# Altium project Orient.PrjPcb (part 3 of 6)

## Sheet HDMI.SchDoc
size A
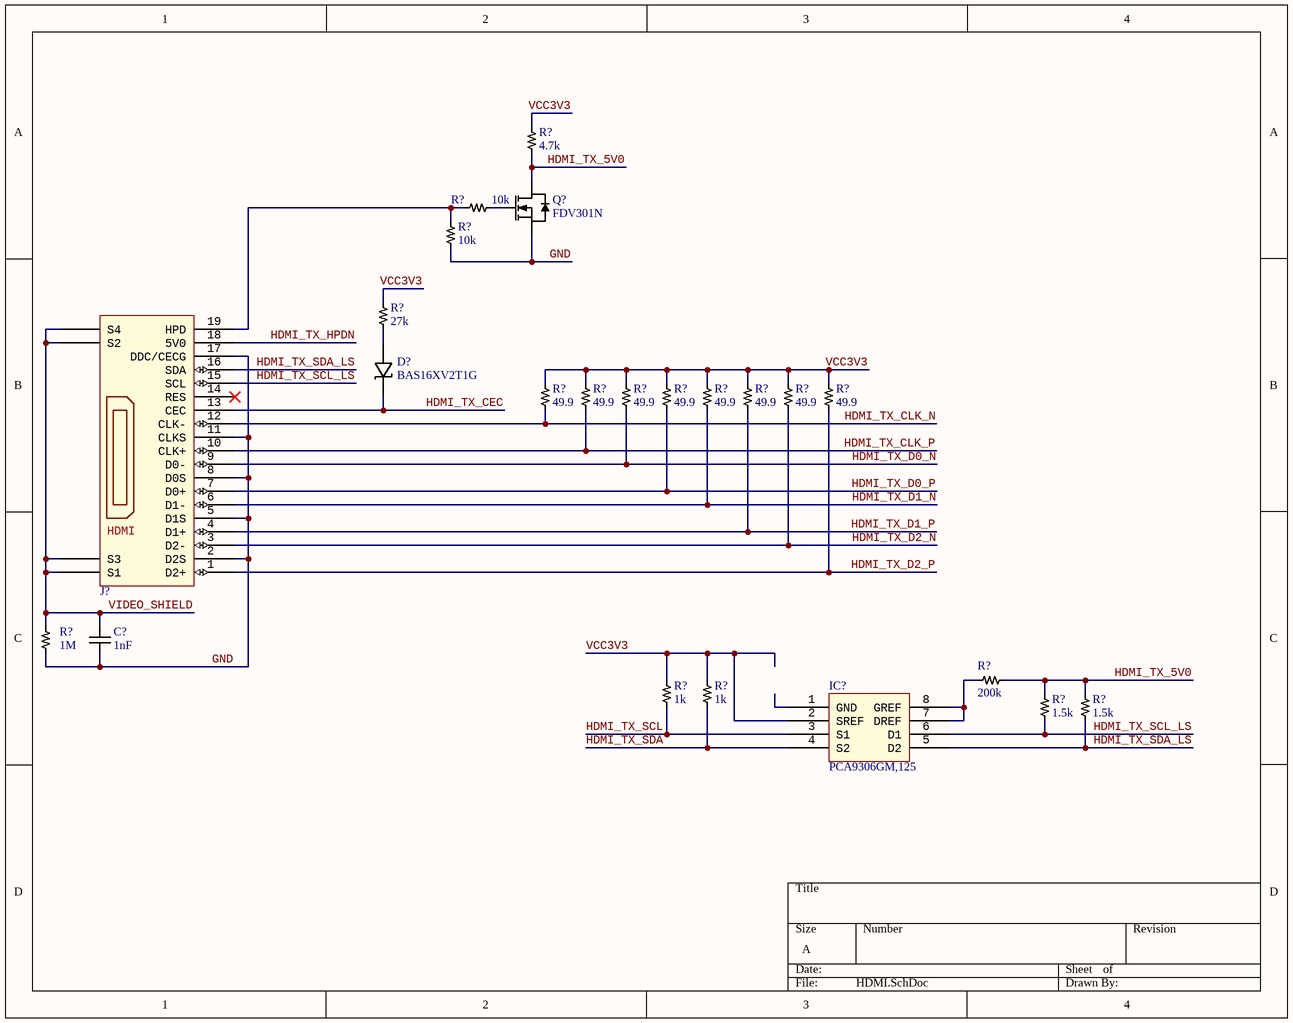
[diagram p3: HDMI.SchDoc]

### Parts
(Parts that share a designator on the sheet are numbered #1, #2 ... from top to bottom, then left to right.)
C?#10  1nF  [CAP0603]
D?#21  BAS16XV2T1G
IC?#3  PCA9306GM,125  [XQFN8]
J?#10  HDMI Connector  [HDMI]  (value not drawn)
Q?#1  FDV301N  [SOT-23]
R?#100  4.7k  [RES0402]
R?#101  10k  [RES0402]
R?#102  10k  [RES0402]
R?#103  27k  [RES0402]
R?#104  49.9  [RES0402]
R?#105  49.9  [RES0402]
R?#106  49.9  [RES0402]
R?#107  49.9  [RES0402]
R?#108  49.9  [RES0402]
R?#109  49.9  [RES0402]
R?#110  49.9  [RES0402]
R?#111  49.9  [RES0402]
R?#112  1M  [RES0402]
R?#113  200k  [RES0402]
R?#114  1k  [RES0402]
R?#115  1k  [RES0402]
R?#116  1.5k  [RES0402]
R?#117  1.5k  [RES0402]

### Nets
GND: C?#10.2 J?#10.2(D2S) J?#10.5(D1S) J?#10.8(D0S) J?#10.11(CLKS) J?#10.17(DDC/CECG) Q?#1.2(S) R?#102.1 R?#112.1
HDMI_TX_5V0: Q?#1.3(D) R?#100.1 R?#113.2 R?#116.2 R?#117.2
HDMI_TX_CEC: D?#21.1(C) J?#10.13(CEC)
HDMI_TX_CLK_N: J?#10.12(CLK-) R?#104.1
HDMI_TX_CLK_P: J?#10.10(CLK+) R?#105.1
HDMI_TX_D0_N: J?#10.9(D0-) R?#106.1
HDMI_TX_D0_P: J?#10.7(D0+) R?#107.1
HDMI_TX_D1_N: J?#10.6(D1-) R?#108.1
HDMI_TX_D1_P: J?#10.4(D1+) R?#109.1
HDMI_TX_D2_N: J?#10.3(D2-) R?#110.1
HDMI_TX_D2_P: J?#10.1(D2+) R?#111.1
HDMI_TX_HPDN: J?#10.18(5V0)
HDMI_TX_SCL: IC?#3.3(S1) R?#114.1
HDMI_TX_SCL_LS: IC?#3.6(D1) J?#10.15(SCL) R?#116.1
HDMI_TX_SDA: IC?#3.4(S2) R?#115.1
HDMI_TX_SDA_LS: IC?#3.5(D2) J?#10.16(SDA) R?#117.1
VCC3V3: IC?#3.2(SREF) R?#100.2 R?#103.2 R?#104.2 R?#105.2 R?#106.2 R?#107.2 R?#108.2 R?#109.2 R?#110.2 R?#111.2 R?#114.2 R?#115.2
VIDEO_SHIELD: C?#10.1 J?#10.S1 J?#10.S2 J?#10.S3 J?#10.S4 R?#112.2
NetD?#21_2: D?#21.2(A) R?#103.1
NetIC?#3_7: IC?#3.7(DREF) IC?#3.8(GREF) R?#113.1
NetJ?#10_19: J?#10.19(HPD) R?#101.1 R?#102.2
NetQ?#1_1: Q?#1.1(G) R?#101.2

Not connected (* = marked no-connect by the designer): IC?#3 1(GND); J?#10 14(RES)*

### Library data of the parts
C?#10 = CC0603KRX7RYBB102: MLCC 1nF 250V 0603 SMD; Manufacturer: Yageo; Tolerance: 10%; Supplier 1: Digi-Key; Manufacturer Part Number: CC0603KRX7RYBB102; Stock 1: 12106; Pricing 1: 1=0.19000, 10=0.12900, 100=0.06540, 500=0.04478, 1000=0.03961 (USD); RoHS: Yes; Mount: Surface Mount; Case/Package: 0603; Min Operating Temperature: -55°C; Max Operating Temperature: 125°C; Packaging: Tape and Reel; Capacitance: 1nF; Voltage Rating: 250V; Length: 0.063inch; Width: 0.031inch; Thickness: 0.035inch; ComponentLink1URL: http://www.yageo.com/exep/pages/download/literatures/ProductSelectionGuide%202014_Final_2.pdf?src-supplier=Digi-Key; ComponentLink1Description: http://www.yageo.com/exep/pages/download/literatures/ProductSelectionGuide%202014_Final_2.pdf?src-supplier=Digi-Key; ComponentLink2URL: http://www.yageo.com/documents/recent/UPY-NP0X7R_MV_100-to-630V_21.pdf?src-supplier=Digi-Key; ComponentLink2Description: http://www.yageo.com/documents/recent/UPY-NP0X7R_MV_100-to-630V_21.pdf?src-supplier=Digi-Key
D?#21 = BAS16XV2T1G: DIODE GEN PURP 75V 200MA SOD523; Manufacturer: ON Semiconductor; Peak Reverse Current: 1uA; Reverse Recovery Time: 6ns; Power Dissipation: 200mW; Element Configuration: Single; Max Surge Current: 500mA; Forward Voltage: 1.25V; Polarity: Standard; Capacitance: 2pF; Supplier 1: Digi-Key; Manufacturer Part Number: BAS16XV2T1G; Stock 1: 246361; Pricing 1: 1=0.13000, 10=0.11600, 100=0.06330, 500=0.03898, 1000=0.02658 (USD); RoHS: Yes; Case/Package: SOD-523-2; Number of Pins: 2; Contact Plating: Tin,Matte; Min Operating Temperature: -55°C; Max Operating Temperature: 150°C; Package Quantity: 1; Forward Current: 200mA; Packaging: Tape and Reel; Average Rectified Current: 200mA; Max Repetitive Reverse Voltage (Vrrm): 75V; Max Reverse Voltage (DC): 75V; Recovery Time: 6ns; Max Reverse Leakage Current: 1uA; Peak Non-Repetitive Surge Current: 500mA; Max Forward Surge Current (Ifsm): 500mA; Output Current: 200mA; Length: 1.3mm; Height: 0.7mm; Width: 0.9mm; Radiation Hardening: No; Lead Free: Lead Free; Halogen Free: Halogen Free; REACH SVHC: No SVHC; ComponentLink1URL: https://datasheet.ciiva.com/915/bas16xv2t1-d-915360.pdf?src-supplier=Digi-Key; ComponentLink1Description: https://datasheet.ciiva.com/915/bas16xv2t1-d-915360.pdf?src-supplier=Digi-Key; ComponentLink2URL: https://datasheet.ciiva.com/4434/bas16xv2t1-d-103464-4434928.pdf?src-supplier=Mouser; ComponentLink2Description: https://datasheet.ciiva.com/4434/bas16xv2t1-d-103464-4434928.pdf?src-supplier=Mouser; ComponentLink3URL: https://datasheet.ciiva.com/22663/1708232-22663646.pdf?src-supplier=Element14; ComponentLink3Description: https://datasheet.ciiva.com/22663/1708232-22663646.pdf?src-supplier=Element14; ComponentLink4URL: https://datasheet.ciiva.com/36525/806485-36525908.pdf?src-supplier=Jameco; ComponentLink4Description: https://datasheet.ciiva.com/36525/806485-36525908.pdf?src-supplier=Jameco; ComponentLink5URL: https://datasheet.ciiva.com/15144/getdatasheetpartid-84399-15144565.pdf?src-supplier=Verical; ComponentLink5Description: https://datasheet.ciiva.com/15144/getdatasheetpartid-84399-15144565.pdf?src-supplier=Verical; ComponentLink6URL: https://datasheet.ciiva.com/16475/bas16xv2t1-d-16475723.pdf?src-supplier=Avnet+Asia; ComponentLink6Description: https://datasheet.ciiva.com/16475/bas16xv2t1-d-16475723.pdf?src-supplier=Avnet+Asia; ComponentLink7URL: https://datasheet.ciiva.com/25930/bas16xv2t1-d-25930683.pdf?src-supplier=Avnet+Europe; ComponentLink7Description: https://datasheet.ciiva.com/25930/bas16xv2t1-d-25930683.pdf?src-supplier=Avnet+Europe
IC?#3 = PCA9306GM,125: Low Voltage Translator, Bidirectional; Manufacturer: NXP Semiconductors; Max Supply Voltage: 5V; Min Supply Voltage: 0uV; Number of Channels: 2; Propagation Delay: 3.3ns; Supplier 1: Digi-Key; Manufacturer Part Number: PCA9306GM,125; Stock 1: 9822; Pricing 1: 1=0.74000, 10=0.65200, 100=0.50010, 500=0.39532, 1000=0.31626 (USD); RoHS: Yes; Mount: Surface Mount; Case/Package: QFN; Number of Pins: 8; Contact Plating: Gold; Min Operating Temperature: -40°C; Max Operating Temperature: 85°C; Packaging: Tape and Reel; Package Quantity: 1; Logic Function: Translator; Number of Bits: 2; Turn-On Delay Time: 3.3ns; Output Type: Voltage; Length: 1.65mm; Height: 0.45mm; Width: 1.65mm; Radiation Hardening: No; Lead Free: Lead Free; ComponentLink1URL: https://datasheet.ciiva.com/1898/pca9306-1898993.pdf?src-supplier=Digi-Key; ComponentLink1Description: https://datasheet.ciiva.com/1898/pca9306-1898993.pdf?src-supplier=Digi-Key; ComponentLink2URL: https://datasheet.ciiva.com/1898/pca9306-1898994.pdf?src-supplier=Digi-Key; ComponentLink2Description: https://datasheet.ciiva.com/1898/pca9306-1898994.pdf?src-supplier=Digi-Key; ComponentLink3URL: https://datasheet.ciiva.com/1898/pca9306-1898995.pdf?src-supplier=Digi-Key; ComponentLink3Description: https://datasheet.ciiva.com/1898/pca9306-1898995.pdf?src-supplier=Digi-Key; ComponentLink4URL: https://datasheet.ciiva.com/16209/pca9306-16209430.pdf?src-supplier=Future+Electronics; ComponentLink4Description: https://datasheet.ciiva.com/16209/pca9306-16209430.pdf?src-supplier=Future+Electronics; ComponentLink5URL: https://datasheet.ciiva.com/8243/pca9306-8243976.pdf?src-supplier=Avnet; ComponentLink5Description: https://datasheet.ciiva.com/8243/pca9306-8243976.pdf?src-supplier=Avnet; ComponentLink6URL: https://datasheet.ciiva.com/16671/pca9306-16671482.pdf?src-supplier=Avnet+Europe; ComponentLink6Description: https://datasheet.ciiva.com/16671/pca9306-16671482.pdf?src-supplier=Avnet+Europe
J?#10 = 10029449-111RLF: HDMI 1.4 Connector 19 Position; Manufacturer: Amphenol FCI; Body Material: Stainless Steel; Gender: Receptacle; Voltage Rating: 40V; Number of Contacts: 19; Insulation Resistance: 100MR; Number of Ports: 1; Pitch: 0.5mm; Supplier 1: Digi-Key; Manufacturer Part Number: 10029449-111RLF; Stock 1: 21394; Pricing 1: 1=0.80000, 10=0.74700, 25=0.67200, 50=0.59740, 100=0.57250 (USD); RoHS: Yes; Mount: Surface Mount,Horizontal; Contact Material: Copper Alloy,Bronze; Contact Plating: Gold; Color: Black; Number of Terminals: 19; Housing Material: Thermoplastic; Min Operating Temperature: -55°C; Max Operating Temperature: 85°C; Termination: Solder; Orientation: Right Angle; Package Quantity: 400; Packaging: Tape and Reel; Connector Type: HDMI; Number of Positions: 19; Max Voltage Rating (AC): 40V; Features: Shielded; Length: 15.7mm; Depth: 9.5mm; Radiation Hardening: No; REACH SVHC: No SVHC; Lead Free: Lead Free; ComponentLink1URL: https://datasheet.ciiva.com/851/10029449-851120.pdf?src-supplier=Digi-Key; ComponentLink1Description: https://datasheet.ciiva.com/851/10029449-851120.pdf?src-supplier=Digi-Key; ComponentLink2URL: https://datasheet.ciiva.com/851/10029449-851118.pdf?src-supplier=Digi-Key; ComponentLink2Description: https://datasheet.ciiva.com/851/10029449-851118.pdf?src-supplier=Digi-Key; ComponentLink3URL: https://datasheet.ciiva.com/851/10029449-851119.pdf?src-supplier=Digi-Key; ComponentLink3Description: https://datasheet.ciiva.com/851/10029449-851119.pdf?src-supplier=Digi-Key
Q?#1 = FDV301N: Digital FET, N-Channel, 0.35 W, 25 V, -55 to 150 degC, 3-Pin SOT23, RoHS, Tape and Reel; Manufacturer: Fairchild; Rds(on) Test Voltage Vgs: 2.7V; Threshold Voltage Vgs Typ: 850mV; Voltage Vds Typ: 25V; Reel Quantity: 3000; Voltage Vgs Rds on Measurement: 4.5V; Power Dissipation Pd: 350mW; Continuous Drain Current Id: 220mA; Transistor Polarity: NChannel; No. of Transistors: 1; Package Version: Rev. 12, 03/2016; Voltage Vgs th Max: 1.5V; ESD HBM: 6kV; Pulse Current Idm: 500mA; Current Temperature: 25degC; On Resistance Rds(on): 5ohm; External Depth: 2.5mm; SMD Marking: 301; No. of Pins: 3; External Width: 3.05mm; SVHC: NoSVHC(19-Dec-2012); External Length / Height: 1.12mm; Termination Type: SMD; Transistor Case Style: SOT-23; Package Reference: SOT23-3; Package URL: http://www.fairchildsemi.com/dwg/MA/MA03D.pdf; Voltage Vgs Max: 850mV; Drain Source Voltage Vds: 25V; Operating Temperature Max: 150degC; Package Description: 3-Pin Small Outline Transistor, Body 2.92 x 1.325 mm, Pitch 0.95 mm; Operating Temperature Min: -55degC; Datasheet Version: Jun-09; Tape Width: 8mm; Full Power Rating Temperature: 25degC; Datasheet URL: https://datasheet.ciiva.com/8114/fdv301n-8114688.pdf; Package / Case: SOT-23; Manufacturer URL: https://www.fairchildsemi.com/; Current Id Max: 220mA; Operating Temperature Range: -55degCto+150degC
R?#100 = RC0402FR-074K7L: Resistor 4.7kOhm 0402 SMD; Manufacturer: Yageo; Voltage Rating (DC): 50V; Tolerance: 1%; Power Rating: 62.5mW; Resistance: 4.7kR; Temperature Coefficient: 100ppm/°C; Supplier 1: Digi-Key; Manufacturer Part Number: RC0402FR-074K7L; Stock 1: 23742940; Pricing 1: 1=0.10000, 10=0.01600, 100=0.00670, 1000=0.00301, 2500=0.00261, 5000=0.00215 (USD); RoHS: Yes; Case/Package: 0402; Number of Pins: 2; Case Code (Imperial): 0402; Case Code (Metric): 1005; Min Operating Temperature: -55°C; Max Operating Temperature: 155°C; Voltage Rating: 50V; Packaging: Tape and Reel; Composition: Thick Film; Termination: SMD/SMT; Military Standard: Not; Length: 1mm; Height: 0.32mm; Width: 0.5mm; Depth: 0.5mm; REACH SVHC: No SVHC; Lead Free: Lead Free; ComponentLink1URL: https://datasheet.ciiva.com/7850/1018594-7850022.pdf?src-supplier=Element14; ComponentLink1Description: https://datasheet.ciiva.com/7850/1018594-7850022.pdf?src-supplier=Element14; ComponentLink2URL: https://datasheet.ciiva.com/7850/1018594-7850023.pdf?src-supplier=Element14; ComponentLink2Description: https://datasheet.ciiva.com/7850/1018594-7850023.pdf?src-supplier=Element14; ComponentLink3URL: https://datasheet.ciiva.com/15215/getdatasheetpartid-328119-15215035.pdf?src-supplier=Verical; ComponentLink3Description: https://datasheet.ciiva.com/15215/getdatasheetpartid-328119-15215035.pdf?src-supplier=Verical; ComponentLink4URL: https://datasheet.ciiva.com/22661/1686128-22661342.pdf?src-supplier=Element14; ComponentLink4Description: https://datasheet.ciiva.com/22661/1686128-22661342.pdf?src-supplier=Element14
R?#101 R?#102 = RC0402FR-0710KL: Resistor 10kOhm 0402 SMD; Manufacturer: Yageo; Resistance: 10kR; Tolerance: 1%; Temperature Coefficient: 100ppm/°C; Voltage Rating: 50V; Power Rating: 62.5mW; Supplier 1: Digi-Key; Manufacturer Part Number: RC0402FR-0710KL; Stock 1: 78932647; Pricing 1: 1=0.10000, 10=0.01500, 100=0.00630, 1000=0.00281, 2500=0.00244, 5000=0.00201 (USD); RoHS: Yes; Case/Package: 0402; Number of Pins: 2; Case Code (Imperial): 0402; Case Code (Metric): 1005; Min Operating Temperature: -55°C; Max Operating Temperature: 155°C; Packaging: Tape and Reel; Composition: Thick Film; Voltage Rating (DC): 50V; Termination: SMD/SMT; Military Standard: Not; Working Voltage: 50V; Number of Terminations: 2; Length: 1mm; Height: 0.32mm; Width: 0.5mm; Depth: 0.5mm; Lead Pitch: 0.2mm; REACH SVHC: No SVHC; Lead Free: Lead Free; ComponentLink1URL: https://datasheet.ciiva.com/7660/38568-7660787.pdf?src-supplier=Element14; ComponentLink1Description: https://datasheet.ciiva.com/7660/38568-7660787.pdf?src-supplier=Element14; ComponentLink2URL: https://datasheet.ciiva.com/7983/1018594-7983486.pdf?src-supplier=Element14; ComponentLink2Description: https://datasheet.ciiva.com/7983/1018594-7983486.pdf?src-supplier=Element14; ComponentLink3URL: https://datasheet.ciiva.com/7849/1784430-7849813.pdf?src-supplier=Element14; ComponentLink3Description: https://datasheet.ciiva.com/7849/1784430-7849813.pdf?src-supplier=Element14; ComponentLink4URL: https://datasheet.ciiva.com/7849/1686128-7849814.pdf?src-supplier=Element14; ComponentLink4Description: https://datasheet.ciiva.com/7849/1686128-7849814.pdf?src-supplier=Element14; ComponentLink5URL: https://datasheet.ciiva.com/7849/1784430-7849815.pdf?src-supplier=Element14; ComponentLink5Description: https://datasheet.ciiva.com/7849/1784430-7849815.pdf?src-supplier=Element14; ComponentLink6URL: https://datasheet.ciiva.com/22747/1018594-22747512.pdf?src-supplier=Element14; ComponentLink6Description: https://datasheet.ciiva.com/22747/1018594-22747512.pdf?src-supplier=Element14; ComponentLink7URL: https://datasheet.ciiva.com/12667/pyu-rc0402-51-rohs-l-6-r-12667067.pdf?src-supplier=Mouser; ComponentLink7Description: https://datasheet.ciiva.com/12667/pyu-rc0402-51-rohs-l-6-r-12667067.pdf?src-supplier=Mouser
R?#103 = RC0402FR-0727KL: Resistor 27kOhm 0402 SMD; Manufacturer: Yageo; Resistance: 27kR; Tolerance: 1%; Power Rating: 63mW; Voltage Rating: 50V; Temperature Coefficient: 100ppm/°C; Supplier 1: Digi-Key; Manufacturer Part Number: RC0402FR-0727KL; Stock 1: 2559160; Pricing 1: 1=0.10000, 10=0.01600, 100=0.00670, 1000=0.00301, 2500=0.00261, 5000=0.00215 (USD); RoHS: Yes; Case/Package: 0402; Case Code (Imperial): 0402; Case Code (Metric): 1005; Min Operating Temperature: -55°C; Max Operating Temperature: 155°C; Packaging: Tape and Reel; Package Quantity: 10000; Termination: SMD/SMT; Composition: Thick Film; Number of Terminations: 2; Military Standard: Not; Max Power Dissipation: 63mW; Features: Moisture Resistant; Length: 1mm; Height: 0.016inch; Width: 0.02inch; Depth: 0.5mm; REACH SVHC: Unknown; Lead Free: Lead Free; ComponentLink1URL: https://datasheet.ciiva.com/11819/0900766b80c66297-11819497.pdf?src-supplier=RSComponents; ComponentLink1Description: https://datasheet.ciiva.com/11819/0900766b80c66297-11819497.pdf?src-supplier=RSComponents; ComponentLink2URL: https://datasheet.ciiva.com/7849/1018594-7849925.pdf?src-supplier=Element14; ComponentLink2Description: https://datasheet.ciiva.com/7849/1018594-7849925.pdf?src-supplier=Element14; ComponentLink3URL: https://datasheet.ciiva.com/2453/pyu-r-int-thick-7-2453562.pdf?src-supplier=Digi-Key; ComponentLink3Description: https://datasheet.ciiva.com/2453/pyu-r-int-thick-7-2453562.pdf?src-supplier=Digi-Key; ComponentLink4URL: https://datasheet.ciiva.com/16772/pyu-rc0402-51-rohs-l-6-r-16772092.pdf?src-supplier=Future+Electronics; ComponentLink4Description: https://datasheet.ciiva.com/16772/pyu-rc0402-51-rohs-l-6-r-16772092.pdf?src-supplier=Future+Electronics
R?#104-R?#111 = RC0402FR-0749R9L: Resistor 49.9Ohm 0402 SMD; Manufacturer: Yageo; Resistance: 49.9R; Tolerance: 1%; Power Rating: 62.5mW; Voltage Rating: 50V; Temperature Coefficient: 100ppm/°C; Max Power Dissipation: 63mW; Supplier 1: Digi-Key; Manufacturer Part Number: RC0402FR-0749R9L; Stock 1: 19217561; Pricing 1: 1=0.10000, 10=0.01600, 100=0.00670, 1000=0.00301, 2500=0.00261, 5000=0.00215 (USD); RoHS: Yes; Case/Package: 0402; Number of Pins: 2; Case Code (Imperial): 0402; Case Code (Metric): 1005; Min Operating Temperature: -55°C; Max Operating Temperature: 155°C; Packaging: Tape and Reel; Package Quantity: 1; Termination: SMD/SMT; Composition: Thick Film; Number of Terminations: 2; Military Standard: Not; Voltage Rating (DC): 50V; Working Voltage: 50V; Features: Moisture Resistant; Length: 1mm; Height: 0.016inch; Width: 0.5mm; Depth: 0.5mm; REACH SVHC: No SVHC; Lead Free: Lead Free; ComponentLink1URL: https://datasheet.ciiva.com/11819/0900766b80c66297-11819508.pdf?src-supplier=RSComponents; ComponentLink1Description: https://datasheet.ciiva.com/11819/0900766b80c66297-11819508.pdf?src-supplier=RSComponents; ComponentLink2URL: https://datasheet.ciiva.com/7983/1018594-7983542.pdf?src-supplier=Element14; ComponentLink2Description: https://datasheet.ciiva.com/7983/1018594-7983542.pdf?src-supplier=Element14; ComponentLink3URL: https://datasheet.ciiva.com/16743/pyu-rc0402-51-rohs-l-6-r-16743942.pdf?src-supplier=Future+Electronics; ComponentLink3Description: https://datasheet.ciiva.com/16743/pyu-rc0402-51-rohs-l-6-r-16743942.pdf?src-supplier=Future+Electronics; ComponentLink4URL: https://datasheet.ciiva.com/22747/1018594-22747514.pdf?src-supplier=Element14; ComponentLink4Description: https://datasheet.ciiva.com/22747/1018594-22747514.pdf?src-supplier=Element14; ComponentLink5URL: https://datasheet.ciiva.com/2453/pyu-r-int-thick-7-2453355.pdf?src-supplier=Digi-Key; ComponentLink5Description: https://datasheet.ciiva.com/2453/pyu-r-int-thick-7-2453355.pdf?src-supplier=Digi-Key; ComponentLink6URL: https://datasheet.ciiva.com/2453/pyu-r-int-thick-7-2453356.pdf?src-supplier=Digi-Key; ComponentLink6Description: https://datasheet.ciiva.com/2453/pyu-r-int-thick-7-2453356.pdf?src-supplier=Digi-Key; ComponentLink7URL: https://datasheet.ciiva.com/2453/pyu-r-int-thick-7-2453357.pdf?src-supplier=Digi-Key; ComponentLink7Description: https://datasheet.ciiva.com/2453/pyu-r-int-thick-7-2453357.pdf?src-supplier=Digi-Key
R?#112 = RC0402FR-071ML: Resistor 1MOhm 0402 SMD; Manufacturer: Yageo; Resistance: 1MR; Tolerance: 1%; Power Rating: 63mW; Voltage Rating: 50V; Temperature Coefficient: 100ppm/°C; Supplier 1: Digi-Key; Manufacturer Part Number: RC0402FR-071ML; Stock 1: 12663284; Pricing 1: 1=0.10000, 10=0.01500, 100=0.00620, 1000=0.00278, 2500=0.00242, 5000=0.00200 (USD); RoHS: Yes; Case/Package: 0402; Case Code (Imperial): 0402; Case Code (Metric): 1005; Min Operating Temperature: -55°C; Max Operating Temperature: 155°C; Composition: Thick Film; Packaging: Tape and Reel; Termination: SMD/SMT; Military Standard: Not; Length: 1mm; Height: 0.32mm; Depth: 0.5mm; REACH SVHC: Unknown; Lead Free: Lead Free; ComponentLink1URL: https://datasheet.ciiva.com/11808/0900766b80c66297-11808125.pdf?src-supplier=RSComponents; ComponentLink1Description: https://datasheet.ciiva.com/11808/0900766b80c66297-11808125.pdf?src-supplier=RSComponents; ComponentLink2URL: https://datasheet.ciiva.com/16741/pyu-rc0402-51-rohs-l-6-r-16741081.pdf?src-supplier=Future+Electronics; ComponentLink2Description: https://datasheet.ciiva.com/16741/pyu-rc0402-51-rohs-l-6-r-16741081.pdf?src-supplier=Future+Electronics; ComponentLink3URL: https://datasheet.ciiva.com/46394/1018594-46394951.pdf?src-supplier=Element14; ComponentLink3Description: https://datasheet.ciiva.com/46394/1018594-46394951.pdf?src-supplier=Element14; ComponentLink4URL: https://datasheet.ciiva.com/7849/1018594-7849882.pdf?src-supplier=Element14; ComponentLink4Description: https://datasheet.ciiva.com/7849/1018594-7849882.pdf?src-supplier=Element14; ComponentLink5URL: https://datasheet.ciiva.com/7849/1018594-7849883.pdf?src-supplier=Element14; ComponentLink5Description: https://datasheet.ciiva.com/7849/1018594-7849883.pdf?src-supplier=Element14
R?#113 = RC0402FR-07200KL: Resistor 200kOhm 0402 SMD; Manufacturer: Yageo; Power Rating: 62.5mW; Tolerance: 1%; Temperature Coefficient: 100ppm/°C; Resistance: 200kR; Voltage Rating: 50V; Max Power Dissipation: 63mW; Supplier 1: Digi-Key; Manufacturer Part Number: RC0402FR-07200KL; Stock 1: 4653507; Pricing 1: 1=0.10000, 10=0.01600, 100=0.00670, 1000=0.00301, 2500=0.00261, 5000=0.00215 (USD); RoHS: Yes; Case/Package: 0402; Case Code (Metric): 1005; Case Code (Imperial): 0402; Min Operating Temperature: -55°C; Max Operating Temperature: 155°C; Package Quantity: 1; Packaging: Tape and Reel; Composition: Thick Film; Number of Terminations: 2; Termination: SMD/SMT; Military Standard: Not; Voltage Rating (DC): 50V; Working Voltage: 50V; Features: Moisture Resistant; Length: 1mm; Height: 0.016inch; Depth: 0.5mm; Width: 0.02inch; REACH SVHC: No SVHC; Lead Free: Lead Free; ComponentLink1URL: https://datasheet.ciiva.com/2453/pyu-r-int-thick-7-2453556.pdf?src-supplier=Digi-Key; ComponentLink1Description: https://datasheet.ciiva.com/2453/pyu-r-int-thick-7-2453556.pdf?src-supplier=Digi-Key; ComponentLink2URL: https://datasheet.ciiva.com/2453/pyu-r-int-thick-7-2453557.pdf?src-supplier=Digi-Key; ComponentLink2Description: https://datasheet.ciiva.com/2453/pyu-r-int-thick-7-2453557.pdf?src-supplier=Digi-Key; ComponentLink3URL: https://datasheet.ciiva.com/15189/getdatasheetpartid-323720-15189381.pdf?src-supplier=Verical; ComponentLink3Description: https://datasheet.ciiva.com/15189/getdatasheetpartid-323720-15189381.pdf?src-supplier=Verical; ComponentLink4URL: https://datasheet.ciiva.com/2453/pyu-r-int-thick-7-2453558.pdf?src-supplier=Digi-Key; ComponentLink4Description: https://datasheet.ciiva.com/2453/pyu-r-int-thick-7-2453558.pdf?src-supplier=Digi-Key; ComponentLink5URL: https://datasheet.ciiva.com/12667/pyu-rc0402-51-rohs-l-6-r-12667911.pdf?src-supplier=Mouser; ComponentLink5Description: https://datasheet.ciiva.com/12667/pyu-rc0402-51-rohs-l-6-r-12667911.pdf?src-supplier=Mouser; ComponentLink6URL: https://datasheet.ciiva.com/7849/1018594-7849896.pdf?src-supplier=Element14; ComponentLink6Description: https://datasheet.ciiva.com/7849/1018594-7849896.pdf?src-supplier=Element14; ComponentLink7URL: https://datasheet.ciiva.com/7849/1018594-7849897.pdf?src-supplier=Element14; ComponentLink7Description: https://datasheet.ciiva.com/7849/1018594-7849897.pdf?src-supplier=Element14; ComponentLink8URL: https://datasheet.ciiva.com/46394/1018594-46394953.pdf?src-supplier=Element14; ComponentLink8Description: https://datasheet.ciiva.com/46394/1018594-46394953.pdf?src-supplier=Element14; ComponentLink9URL: https://datasheet.ciiva.com/16740/pyu-rc0402-51-rohs-l-6-r-16740636.pdf?src-supplier=Future+Electronics; ComponentLink9Description: https://datasheet.ciiva.com/16740/pyu-rc0402-51-rohs-l-6-r-16740636.pdf?src-supplier=Future+Electronics
R?#114 R?#115 = RC0402FR-071KL: Resistor 1kOhm 0402 SMD; Manufacturer: Yageo; Tolerance: 1%; Resistance: 1kR; Temperature Coefficient: 100ppm/°C; Voltage Rating (DC): 50V; Power Rating: 62.5mW; Supplier 1: Digi-Key; Manufacturer Part Number: RC0402FR-071KL; Stock 1: 60632232; Pricing 1: 1=0.10000, 10=0.01600, 100=0.00670, 1000=0.00301, 2500=0.00261, 5000=0.00215 (USD); RoHS: Yes; Case/Package: 0402; Number of Pins: 2; Case Code (Imperial): 0402; Case Code (Metric): 1005; Min Operating Temperature: -55°C; Max Operating Temperature: 155°C; Composition: Thick Film; Packaging: Tape and Reel; Voltage Rating: 50V; Termination: SMD/SMT; Military Standard: Not; Length: 1mm; Height: 0.32mm; Width: 0.5mm; Depth: 0.5mm; REACH SVHC: Unknown; Lead Free: Lead Free; ComponentLink1URL: https://datasheet.ciiva.com/11819/0900766b80c66297-11819477.pdf?src-supplier=RSComponents; ComponentLink1Description: https://datasheet.ciiva.com/11819/0900766b80c66297-11819477.pdf?src-supplier=RSComponents; ComponentLink2URL: https://datasheet.ciiva.com/12666/pyu-rc0402-51-rohs-l-6-r-12666741.pdf?src-supplier=Mouser; ComponentLink2Description: https://datasheet.ciiva.com/12666/pyu-rc0402-51-rohs-l-6-r-12666741.pdf?src-supplier=Mouser; ComponentLink3URL: https://datasheet.ciiva.com/17063/pyu-rc0402-51-rohs-l-6-r-17063193.pdf?src-supplier=Future+Electronics; ComponentLink3Description: https://datasheet.ciiva.com/17063/pyu-rc0402-51-rohs-l-6-r-17063193.pdf?src-supplier=Future+Electronics; ComponentLink4URL: https://datasheet.ciiva.com/22747/1018594-22747513.pdf?src-supplier=Element14; ComponentLink4Description: https://datasheet.ciiva.com/22747/1018594-22747513.pdf?src-supplier=Element14; ComponentLink5URL: https://datasheet.ciiva.com/7849/1018594-7849869.pdf?src-supplier=Element14; ComponentLink5Description: https://datasheet.ciiva.com/7849/1018594-7849869.pdf?src-supplier=Element14; ComponentLink6URL: https://datasheet.ciiva.com/7983/1018594-7983502.pdf?src-supplier=Element14; ComponentLink6Description: https://datasheet.ciiva.com/7983/1018594-7983502.pdf?src-supplier=Element14; ComponentLink7URL: https://datasheet.ciiva.com/7849/1018594-7849871.pdf?src-supplier=Element14; ComponentLink7Description: https://datasheet.ciiva.com/7849/1018594-7849871.pdf?src-supplier=Element14
R?#116 R?#117 = RC0402FR-071K5L: Resistor 1.5kOhm 0402 SMD; Manufacturer: Yageo; Resistance: 1.5kR; Power Rating: 62.5mW; Tolerance: 1%; Voltage Rating: 50V; Temperature Coefficient: 100ppm/°C; Max Power Dissipation: 63mW; Supplier 1: Digi-Key; Manufacturer Part Number: RC0402FR-071K5L; Stock 1: 9153842; Pricing 1: 1=0.10000, 10=0.01600, 100=0.00670, 1000=0.00301, 2500=0.00261, 5000=0.00215 (USD); RoHS: Yes; Case/Package: 0402; Case Code (Metric): 1005; Case Code (Imperial): 0402; Min Operating Temperature: -55°C; Max Operating Temperature: 155°C; Composition: Thick Film; Package Quantity: 1; Packaging: Tape and Reel; Number of Terminations: 2; Termination: SMD/SMT; Military Standard: Not; Features: Moisture Resistant; Length: 1mm; Height: 0.016inch; Width: 0.02inch; Depth: 0.5mm; REACH SVHC: No SVHC; Lead Free: Lead Free; ComponentLink1URL: https://datasheet.ciiva.com/11808/0900766b80c66297-11808238.pdf?src-supplier=RSComponents; ComponentLink1Description: https://datasheet.ciiva.com/11808/0900766b80c66297-11808238.pdf?src-supplier=RSComponents; ComponentLink2URL: https://datasheet.ciiva.com/2453/pyu-r-int-thick-7-2453440.pdf?src-supplier=Digi-Key; ComponentLink2Description: https://datasheet.ciiva.com/2453/pyu-r-int-thick-7-2453440.pdf?src-supplier=Digi-Key; ComponentLink3URL: https://datasheet.ciiva.com/2453/pyu-r-int-thick-7-2453441.pdf?src-supplier=Digi-Key; ComponentLink3Description: https://datasheet.ciiva.com/2453/pyu-r-int-thick-7-2453441.pdf?src-supplier=Digi-Key; ComponentLink4URL: https://datasheet.ciiva.com/46394/1018594-46394950.pdf?src-supplier=Element14; ComponentLink4Description: https://datasheet.ciiva.com/46394/1018594-46394950.pdf?src-supplier=Element14; ComponentLink5URL: https://datasheet.ciiva.com/7849/1018594-7849863.pdf?src-supplier=Element14; ComponentLink5Description: https://datasheet.ciiva.com/7849/1018594-7849863.pdf?src-supplier=Element14; ComponentLink6URL: https://datasheet.ciiva.com/7849/1018594-7849864.pdf?src-supplier=Element14; ComponentLink6Description: https://datasheet.ciiva.com/7849/1018594-7849864.pdf?src-supplier=Element14; ComponentLink7URL: https://datasheet.ciiva.com/15189/getdatasheetpartid-323992-15189370.pdf?src-supplier=Verical; ComponentLink7Description: https://datasheet.ciiva.com/15189/getdatasheetpartid-323992-15189370.pdf?src-supplier=Verical; ComponentLink8URL: https://datasheet.ciiva.com/12558/pyu-rc0402-51-rohs-l-6-r-8721-12558542.pdf?src-supplier=Mouser; ComponentLink8Description: https://datasheet.ciiva.com/12558/pyu-rc0402-51-rohs-l-6-r-8721-12558542.pdf?src-supplier=Mouser; ComponentLink9URL: https://datasheet.ciiva.com/2453/pyu-r-int-thick-7-2453439.pdf?src-supplier=Digi-Key; ComponentLink9Description: https://datasheet.ciiva.com/2453/pyu-r-int-thick-7-2453439.pdf?src-supplier=Digi-Key

## Sheet USB_Mic_Audio_Out.SchDoc
size A

## Sheet FPGA_Config_Flash.SchDoc
size A
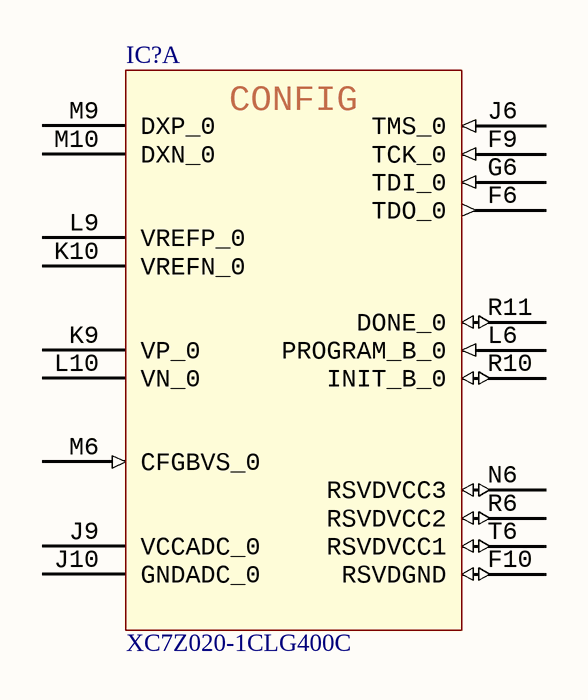
[diagram p4: FPGA_Config_Flash.SchDoc]

### Parts
(Parts that share a designator on the sheet are numbered #1, #2 ... from top to bottom, then left to right.)
IC?#4  XC7Z020-1CLG400C  [BGA400]  (part A of 9)

### Nets

Not connected (* = marked no-connect by the designer): IC?#4 F6(TDO_0) F9(TCK_0) F10(RSVDGND) G6(TDI_0) J6(TMS_0) J9(VCCADC_0) J10(GNDADC_0) K9(VP_0) K10(VREFN_0) L6(PROGRAM_B_0) L9(VREFP_0) L10(VN_0) M6(CFGBVS_0) M9(DXP_0) M10(DXN_0) N6(RSVDVCC3) R6(RSVDVCC2) R10(INIT_B_0) R11(DONE_0) T6(RSVDVCC1)

### Notes on the sheet
- (in symbol XC7Z020-1CLG400C, part A) CONFIG

### Library data of the parts
IC?#4 = XC7Z020-1CLG400C: Zynq-7000 SoC.; ComponentLink1Description: Digi-Key; ComponentLink1URL: https://www.digikey.com/product-detail/en/xilinx-inc/XC7Z020-1CLG400C/122-1851-ND/3925758?utm_adgroup=Integrated Circuits&slid=&gclid=Cj0KCQjwn_LrBRD4ARIsAFEQFKtYXIOPieaS_xsLL2AvFALkVw3M5siD0KQOWM0owpA_yiQuHKATBqcaAuQ6EALw_wcB

## Sheet DDR_MIO_Banks.SchDoc
size A
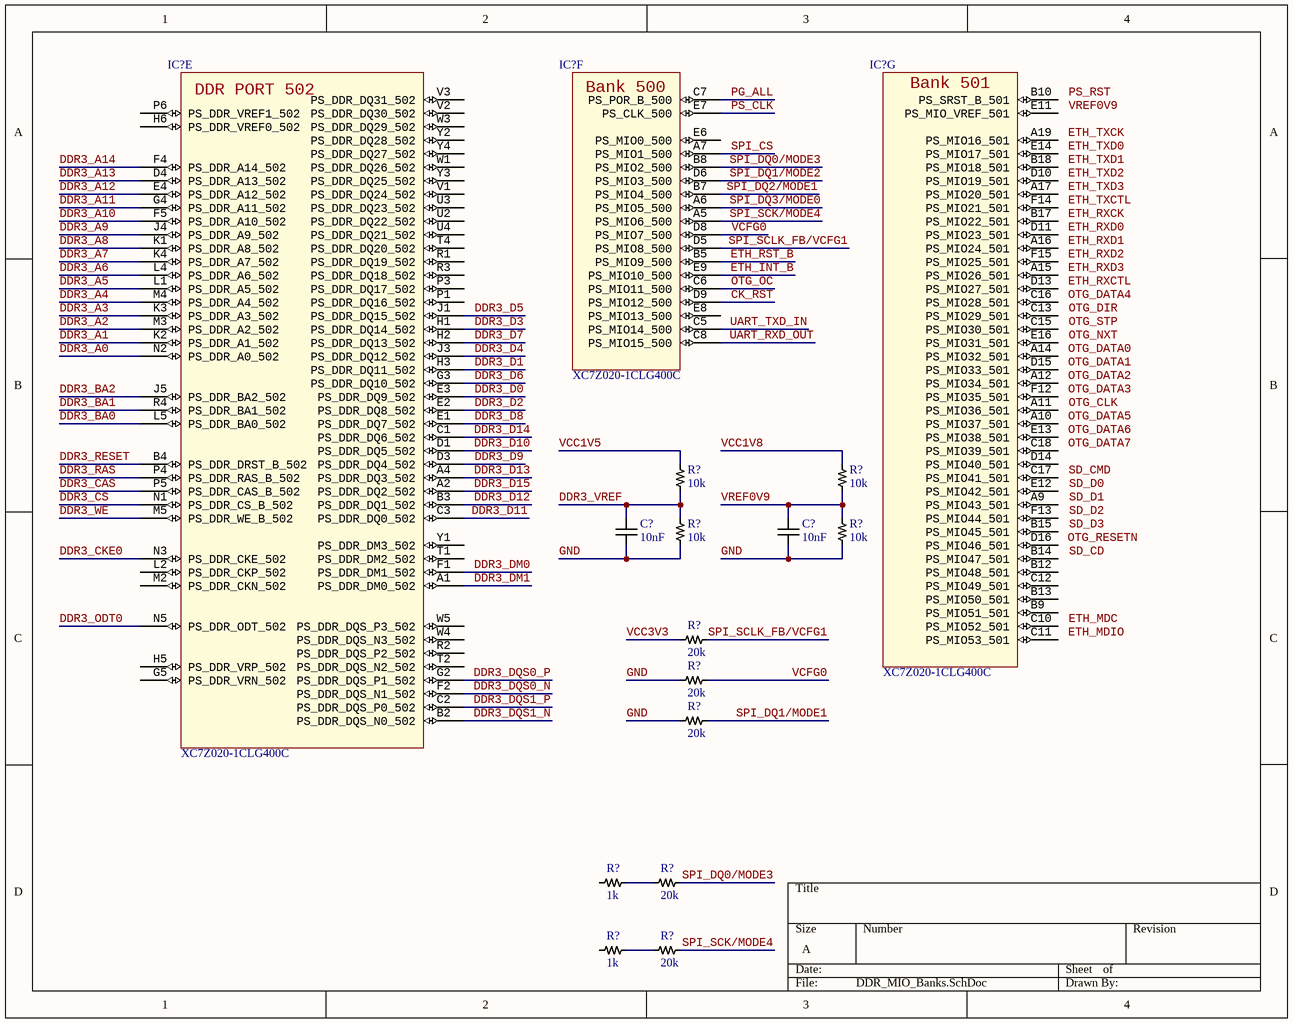
[diagram p5: DDR_MIO_Banks.SchDoc]

### Parts
(Parts that share a designator on the sheet are numbered #1, #2 ... from top to bottom, then left to right.)
C?#11  10nF  [CAP0402]
C?#12  10nF  [CAP0402]
IC?#5  XC7Z020-1CLG400C  [BGA400]  (part F of 9)
IC?#6  XC7Z020-1CLG400C  [BGA400]  (part G of 9)
IC?#7  XC7Z020-1CLG400C  [BGA400]  (part E of 9)
R?#118  10k  [RES0402]
R?#119  10k  [RES0402]
R?#120  10k  [RES0402]
R?#121  10k  [RES0402]
R?#122  20k  [RES0402]
R?#123  20k  [RES0402]
R?#124  20k  [RES0402]
R?#125  1k  [RES0402]
R?#126  20k  [RES0402]
R?#127  1k  [RES0402]
R?#128  20k  [RES0402]

### Nets
GND: C?#11.2 C?#12.2 R?#120.1 R?#121.1 R?#123.1 R?#124.1
CK_RST: IC?#5.D9(PS_MIO12_500)
DDR3_A0: IC?#7.N2(PS_DDR_A0_502)
DDR3_A1: IC?#7.K2(PS_DDR_A1_502)
DDR3_A2: IC?#7.M3(PS_DDR_A2_502)
DDR3_A3: IC?#7.K3(PS_DDR_A3_502)
DDR3_A4: IC?#7.M4(PS_DDR_A4_502)
DDR3_A5: IC?#7.L1(PS_DDR_A5_502)
DDR3_A6: IC?#7.L4(PS_DDR_A6_502)
DDR3_A7: IC?#7.K4(PS_DDR_A7_502)
DDR3_A8: IC?#7.K1(PS_DDR_A8_502)
DDR3_A9: IC?#7.J4(PS_DDR_A9_502)
DDR3_A10: IC?#7.F5(PS_DDR_A10_502)
DDR3_A11: IC?#7.G4(PS_DDR_A11_502)
DDR3_A12: IC?#7.E4(PS_DDR_A12_502)
DDR3_A13: IC?#7.D4(PS_DDR_A13_502)
DDR3_A14: IC?#7.F4(PS_DDR_A14_502)
DDR3_BA0: IC?#7.L5(PS_DDR_BA0_502)
DDR3_BA1: IC?#7.R4(PS_DDR_BA1_502)
DDR3_BA2: IC?#7.J5(PS_DDR_BA2_502)
DDR3_CAS: IC?#7.P5(PS_DDR_CAS_B_502)
DDR3_CKE0: IC?#7.N3(PS_DDR_CKE_502)
DDR3_CS: IC?#7.N1(PS_DDR_CS_B_502)
DDR3_D0: IC?#7.E3(PS_DDR_DQ9_502)
DDR3_D1: IC?#7.H3(PS_DDR_DQ11_502)
DDR3_D2: IC?#7.E2(PS_DDR_DQ8_502)
DDR3_D3: IC?#7.H1(PS_DDR_DQ14_502)
DDR3_D4: IC?#7.J3(PS_DDR_DQ12_502)
DDR3_D5: IC?#7.J1(PS_DDR_DQ15_502)
DDR3_D6: IC?#7.G3(PS_DDR_DQ10_502)
DDR3_D7: IC?#7.H2(PS_DDR_DQ13_502)
DDR3_D8: IC?#7.E1(PS_DDR_DQ7_502)
DDR3_D9: IC?#7.D3(PS_DDR_DQ4_502)
DDR3_D10: IC?#7.D1(PS_DDR_DQ5_502)
DDR3_D11: IC?#7.C3(PS_DDR_DQ0_502)
DDR3_D12: IC?#7.B3(PS_DDR_DQ1_502)
DDR3_D13: IC?#7.A4(PS_DDR_DQ3_502)
DDR3_D14: IC?#7.C1(PS_DDR_DQ6_502)
DDR3_D15: IC?#7.A2(PS_DDR_DQ2_502)
DDR3_DM0: IC?#7.F1(PS_DDR_DM1_502)
DDR3_DM1: IC?#7.A1(PS_DDR_DM0_502)
DDR3_DQS0_N: IC?#7.F2(PS_DDR_DQS_N1_502)
DDR3_DQS0_P: IC?#7.G2(PS_DDR_DQS_P1_502)
DDR3_DQS1_N: IC?#7.B2(PS_DDR_DQS_N0_502)
DDR3_DQS1_P: IC?#7.C2(PS_DDR_DQS_P0_502)
DDR3_ODT0: IC?#7.N5(PS_DDR_ODT_502)
DDR3_RAS: IC?#7.P4(PS_DDR_RAS_B_502)
DDR3_RESET: IC?#7.B4(PS_DDR_DRST_B_502)
DDR3_VREF: C?#11.1 R?#118.1 R?#120.2
DDR3_WE: IC?#7.M5(PS_DDR_WE_B_502)
ETH_INT_B: IC?#5.E9(PS_MIO10_500)
ETH_RST_B: IC?#5.B5(PS_MIO9_500)
OTG_OC: IC?#5.C6(PS_MIO11_500)
PG_ALL: IC?#5.C7(PS_POR_B_500)
PS_CLK: IC?#5.E7(PS_CLK_500)
SPI_CS: IC?#5.A7(PS_MIO1_500)
SPI_DQ0/MODE3: IC?#5.B8(PS_MIO2_500) R?#126.2
SPI_DQ1/MODE1: R?#124.2
SPI_DQ1/MODE2: IC?#5.D6(PS_MIO3_500)
SPI_DQ2/MODE1: IC?#5.B7(PS_MIO4_500)
SPI_DQ3/MODE0: IC?#5.A6(PS_MIO5_500)
SPI_SCK/MODE4: IC?#5.A5(PS_MIO6_500) R?#128.2
SPI_SCLK_FB/VCFG1: IC?#5.D5(PS_MIO8_500) R?#122.2
UART_RXD_OUT: IC?#5.C8(PS_MIO15_500)
UART_TXD_IN: IC?#5.C5(PS_MIO14_500)
VCC1V5: R?#118.2
VCC1V8: R?#119.2
VCC3V3: R?#122.1
VCFG0: IC?#5.D8(PS_MIO7_500) R?#123.2
VREF0V9: C?#12.1 R?#119.1 R?#121.2
NetR?#125_2: R?#125.2 R?#126.1
NetR?#127_2: R?#127.2 R?#128.1

Not connected (* = marked no-connect by the designer): IC?#5 E6(PS_MIO0_500) E8(PS_MIO13_500); IC?#6 A9(PS_MIO43_501) A10(PS_MIO37_501) A11(PS_MIO36_501) A12(PS_MIO34_501) A14(PS_MIO32_501) A15(PS_MIO26_501) A16(PS_MIO24_501) A17(PS_MIO20_501) A19(PS_MIO16_501) B9(PS_MIO51_501) B10(PS_SRST_B_501) B12(PS_MIO48_501) B13(PS_MIO50_501) B14(PS_MIO47_501) B15(PS_MIO45_501) B17(PS_MIO22_501) B18(PS_MIO18_501) C10(PS_MIO52_501) C11(PS_MIO53_501) C12(PS_MIO49_501) C13(PS_MIO29_501) C15(PS_MIO30_501) C16(PS_MIO28_501) C17(PS_MIO41_501) C18(PS_MIO39_501) D10(PS_MIO19_501) D11(PS_MIO23_501) D13(PS_MIO27_501) D14(PS_MIO40_501) D15(PS_MIO33_501) D16(PS_MIO46_501) E11(PS_MIO_VREF_501) E12(PS_MIO42_501) E13(PS_MIO38_501) E14(PS_MIO17_501) E16(PS_MIO31_501) F12(PS_MIO35_501) F13(PS_MIO44_501) F14(PS_MIO21_501) F15(PS_MIO25_501); IC?#7 G5(PS_DDR_VRN_502) H5(PS_DDR_VRP_502) H6(PS_DDR_VREF0_502) L2(PS_DDR_CKP_502) M2(PS_DDR_CKN_502) P1(PS_DDR_DQ16_502) P3(PS_DDR_DQ17_502) P6(PS_DDR_VREF1_502) R1(PS_DDR_DQ19_502) R2(PS_DDR_DQS_P2_502) R3(PS_DDR_DQ18_502) T1(PS_DDR_DM2_502) T2(PS_DDR_DQS_N2_502) T4(PS_DDR_DQ20_502) U2(PS_DDR_DQ22_502) U3(PS_DDR_DQ23_502) U4(PS_DDR_DQ21_502) V1(PS_DDR_DQ24_502) V2(PS_DDR_DQ30_502) V3(PS_DDR_DQ31_502) W1(PS_DDR_DQ26_502) W3(PS_DDR_DQ29_502) W4(PS_DDR_DQS_N3_502) W5(PS_DDR_DQS_P3_502) Y1(PS_DDR_DM3_502) Y2(PS_DDR_DQ28_502) Y3(PS_DDR_DQ25_502) Y4(PS_DDR_DQ27_502); R?#125 1; R?#127 1

### Notes on the sheet
- Labels drawn without touching a wire or pin: ETH_MDC, ETH_MDIO, ETH_RXCK, ETH_RXCTL, ETH_RXD0, ETH_RXD1, ETH_RXD2, ETH_RXD3, ETH_TXCK, ETH_TXCTL, ETH_TXD0, ETH_TXD1, ETH_TXD2, ETH_TXD3, OTG_CLK, OTG_DATA0, OTG_DATA1, OTG_DATA2, OTG_DATA3, OTG_DATA4, OTG_DATA5, OTG_DATA6, OTG_DATA7, OTG_DIR, OTG_NXT, OTG_RESETN, OTG_STP, PS_RST, SD_CD, SD_CMD, SD_D0, SD_D1, SD_D2, SD_D3, VREF0V9
- (in symbol XC7Z020-1CLG400C, part E) DDR PORT 502
- (in symbol XC7Z020-1CLG400C, part F) Bank 500
- (in symbol XC7Z020-1CLG400C, part G) Bank 501

### Library data of the parts
C?#11 C?#12 = GRM155R71H103KA88D: MLCC 10nF 0402 SMD; Manufacturer: Murata; Material: Ceramic; Tolerance: 10%; Voltage Rating: 50V; Dielectric: X7R; Voltage: 25V; Supplier 1: Digi-Key; Manufacturer Part Number: GRM155R71H103KA88D; Stock 1: 7384657; Pricing 1: 1=0.10000, 10=0.03800, 100=0.01690, 500=0.01208, 1000=0.00949, 2500=0.00862, 5000=0.00794 (USD); RoHS: Yes; Mount: Surface Mount; Case/Package: 0402; Number of Pins: 2; Case Code (Metric): 1005; Case Code (Imperial): 0402; Min Operating Temperature: -55°C; Max Operating Temperature: 125°C; Packaging: Tape and Reel; Package Quantity: 1; Termination: SMD/SMT; Capacitance: 10nF; Voltage Rating (DC): 50V; Length: 1mm; Height: 0.5mm; Width: 0.02inch; Thickness: 0.022inch; Depth: 0.5mm; Radiation Hardening: No; REACH SVHC: No SVHC; Lead Free: Lead Free; ComponentLink1URL: https://datasheet.ciiva.com/129/product-129810.pdf?src-supplier=Digi-Key; ComponentLink1Description: https://datasheet.ciiva.com/129/product-129810.pdf?src-supplier=Digi-Key; ComponentLink2URL: https://datasheet.ciiva.com/19476/1856433-19476546.pdf?src-supplier=Jameco; ComponentLink2Description: https://datasheet.ciiva.com/19476/1856433-19476546.pdf?src-supplier=Jameco; ComponentLink3URL: https://datasheet.ciiva.com/11786/0900766b80ef921d-11786340.pdf?src-supplier=RSComponents; ComponentLink3Description: https://datasheet.ciiva.com/11786/0900766b80ef921d-11786340.pdf?src-supplier=RSComponents; ComponentLink4URL: https://datasheet.ciiva.com/18100/getdatasheetpartid-27434-18100660.pdf?src-supplier=Verical; ComponentLink4Description: https://datasheet.ciiva.com/18100/getdatasheetpartid-27434-18100660.pdf?src-supplier=Verical; ComponentLink5URL: https://datasheet.ciiva.com/22698/1747449-22698420.pdf?src-supplier=Element14; ComponentLink5Description: https://datasheet.ciiva.com/22698/1747449-22698420.pdf?src-supplier=Element14; ComponentLink6URL: https://datasheet.ciiva.com/29199/454225-da-01-en-vs-kondensator-0402-29199740.pdf?src-supplier=Conrad; ComponentLink6Description: https://datasheet.ciiva.com/29199/454225-da-01-en-vs-kondensator-0402-29199740.pdf?src-supplier=Conrad; ComponentLink7URL: https://datasheet.ciiva.com/129/grm155r71h103ka88-01-129811.pdf?src-supplier=Digi-Key; ComponentLink7Description: https://datasheet.ciiva.com/129/grm155r71h103ka88-01-129811.pdf?src-supplier=Digi-Key; ComponentLink8URL: https://datasheet.ciiva.com/129/grm155r71h103ka88-01-129812.pdf?src-supplier=Digi-Key; ComponentLink8Description: https://datasheet.ciiva.com/129/grm155r71h103ka88-01-129812.pdf?src-supplier=Digi-Key; ComponentLink9URL: https://datasheet.ciiva.com/16495/product-16495290.pdf?src-supplier=Future+Electronics; ComponentLink9Description: https://datasheet.ciiva.com/16495/product-16495290.pdf?src-supplier=Future+Electronics; ComponentLink10URL: https://datasheet.ciiva.com/5410/product-5410990.pdf?src-supplier=Mouser; ComponentLink10Description: https://datasheet.ciiva.com/5410/product-5410990.pdf?src-supplier=Mouser
IC?#5-IC?#7 = XC7Z020-1CLG400C: Zynq-7000 SoC.; ComponentLink1Description: Digi-Key; ComponentLink1URL: https://www.digikey.com/product-detail/en/xilinx-inc/XC7Z020-1CLG400C/122-1851-ND/3925758?utm_adgroup=Integrated Circuits&slid=&gclid=Cj0KCQjwn_LrBRD4ARIsAFEQFKtYXIOPieaS_xsLL2AvFALkVw3M5siD0KQOWM0owpA_yiQuHKATBqcaAuQ6EALw_wcB
R?#118-R?#121 = RC0402FR-0710KL: as R?#101 on sheet HDMI; Supplier 1: Digi-Key; Manufacturer Part Number: RC0402FR-0710KL; Stock 1: 78932647; Pricing 1: 1=0.10000, 10=0.01500, 100=0.00630, 1000=0.00281, 2500=0.00244, 5000=0.00201 (USD); RoHS: Yes; Case/Package: 0402; Number of Pins: 2; Case Code (Imperial): 0402; Case Code (Metric): 1005; Min Operating Temperature: -55°C; Max Operating Temperature: 155°C; Packaging: Tape and Reel; Composition: Thick Film; Voltage Rating (DC): 50V; Termination: SMD/SMT; Military Standard: Not; Working Voltage: 50V; Number of Terminations: 2; Length: 1mm; Height: 0.32mm; Width: 0.5mm; Depth: 0.5mm; Lead Pitch: 0.2mm; REACH SVHC: No SVHC; Lead Free: Lead Free; ComponentLink1URL: https://datasheet.ciiva.com/7660/38568-7660787.pdf?src-supplier=Element14; ComponentLink1Description: https://datasheet.ciiva.com/7660/38568-7660787.pdf?src-supplier=Element14; ComponentLink2URL: https://datasheet.ciiva.com/7983/1018594-7983486.pdf?src-supplier=Element14; ComponentLink2Description: https://datasheet.ciiva.com/7983/1018594-7983486.pdf?src-supplier=Element14; ComponentLink3URL: https://datasheet.ciiva.com/7849/1784430-7849813.pdf?src-supplier=Element14; ComponentLink3Description: https://datasheet.ciiva.com/7849/1784430-7849813.pdf?src-supplier=Element14; ComponentLink4URL: https://datasheet.ciiva.com/7849/1686128-7849814.pdf?src-supplier=Element14; ComponentLink4Description: https://datasheet.ciiva.com/7849/1686128-7849814.pdf?src-supplier=Element14; ComponentLink5URL: https://datasheet.ciiva.com/7849/1784430-7849815.pdf?src-supplier=Element14; ComponentLink5Description: https://datasheet.ciiva.com/7849/1784430-7849815.pdf?src-supplier=Element14; ComponentLink6URL: https://datasheet.ciiva.com/22747/1018594-22747512.pdf?src-supplier=Element14; ComponentLink6Description: https://datasheet.ciiva.com/22747/1018594-22747512.pdf?src-supplier=Element14; ComponentLink7URL: https://datasheet.ciiva.com/12667/pyu-rc0402-51-rohs-l-6-r-12667067.pdf?src-supplier=Mouser; ComponentLink7Description: https://datasheet.ciiva.com/12667/pyu-rc0402-51-rohs-l-6-r-12667067.pdf?src-supplier=Mouser
R?#122-R?#124 R?#126 R?#128 = RC0402FR-0720KL: Resistor 20kOhm 0402 SMD; Manufacturer: Yageo; Tolerance: 1%; Resistance: 20kR; Power Rating: 62.5mW; Voltage Rating: 50V; Temperature Coefficient: 100ppm/°C; Max Power Dissipation: 63mW; Supplier 1: Digi-Key; Manufacturer Part Number: RC0402FR-0720KL; Stock 1: 5271703; Pricing 1: 1=0.10000, 10=0.01600, 100=0.00670, 1000=0.00301, 2500=0.00261, 5000=0.00215 (USD); RoHS: Yes; Case/Package: 0402; Number of Pins: 2; Case Code (Metric): 1005; Case Code (Imperial): 0402; Min Operating Temperature: -55°C; Max Operating Temperature: 155°C; Package Quantity: 1; Packaging: Tape and Reel; Composition: Thick Film; Number of Terminations: 2; Termination: SMD/SMT; Military Standard: Not; Voltage Rating (DC): 50V; Features: Moisture Resistant; Length: 1mm; Height: 0.016inch; Width: 0.02inch; Depth: 0.5mm; REACH SVHC: No SVHC; Lead Free: Lead Free; ComponentLink1URL: https://datasheet.ciiva.com/11808/0900766b80c66297-11808454.pdf?src-supplier=RSComponents; ComponentLink1Description: https://datasheet.ciiva.com/11808/0900766b80c66297-11808454.pdf?src-supplier=RSComponents; ComponentLink2URL: https://datasheet.ciiva.com/2453/pyu-r-int-thick-7-2453493.pdf?src-supplier=Digi-Key; ComponentLink2Description: https://datasheet.ciiva.com/2453/pyu-r-int-thick-7-2453493.pdf?src-supplier=Digi-Key; ComponentLink3URL: https://datasheet.ciiva.com/2453/pyu-r-int-thick-7-2453494.pdf?src-supplier=Digi-Key; ComponentLink3Description: https://datasheet.ciiva.com/2453/pyu-r-int-thick-7-2453494.pdf?src-supplier=Digi-Key; ComponentLink4URL: https://datasheet.ciiva.com/2453/pyu-r-int-thick-7-2453495.pdf?src-supplier=Digi-Key; ComponentLink4Description: https://datasheet.ciiva.com/2453/pyu-r-int-thick-7-2453495.pdf?src-supplier=Digi-Key; ComponentLink5URL: https://datasheet.ciiva.com/7983/1018594-7983511.pdf?src-supplier=Element14; ComponentLink5Description: https://datasheet.ciiva.com/7983/1018594-7983511.pdf?src-supplier=Element14; ComponentLink6URL: https://datasheet.ciiva.com/12558/pyu-rc0402-51-rohs-l-6-r-8721-12558796.pdf?src-supplier=Mouser; ComponentLink6Description: https://datasheet.ciiva.com/12558/pyu-rc0402-51-rohs-l-6-r-8721-12558796.pdf?src-supplier=Mouser; ComponentLink7URL: https://datasheet.ciiva.com/46394/1018594-46394974.pdf?src-supplier=Element14; ComponentLink7Description: https://datasheet.ciiva.com/46394/1018594-46394974.pdf?src-supplier=Element14
R?#125 R?#127 = RC0402FR-071KL: as R?#114 on sheet HDMI; Supplier 1: Digi-Key; Manufacturer Part Number: RC0402FR-071KL; Stock 1: 60632232; Pricing 1: 1=0.10000, 10=0.01600, 100=0.00670, 1000=0.00301, 2500=0.00261, 5000=0.00215 (USD); RoHS: Yes; Case/Package: 0402; Number of Pins: 2; Case Code (Imperial): 0402; Case Code (Metric): 1005; Min Operating Temperature: -55°C; Max Operating Temperature: 155°C; Composition: Thick Film; Packaging: Tape and Reel; Voltage Rating: 50V; Termination: SMD/SMT; Military Standard: Not; Length: 1mm; Height: 0.32mm; Width: 0.5mm; Depth: 0.5mm; REACH SVHC: Unknown; Lead Free: Lead Free; ComponentLink1URL: https://datasheet.ciiva.com/11819/0900766b80c66297-11819477.pdf?src-supplier=RSComponents; ComponentLink1Description: https://datasheet.ciiva.com/11819/0900766b80c66297-11819477.pdf?src-supplier=RSComponents; ComponentLink2URL: https://datasheet.ciiva.com/12666/pyu-rc0402-51-rohs-l-6-r-12666741.pdf?src-supplier=Mouser; ComponentLink2Description: https://datasheet.ciiva.com/12666/pyu-rc0402-51-rohs-l-6-r-12666741.pdf?src-supplier=Mouser; ComponentLink3URL: https://datasheet.ciiva.com/17063/pyu-rc0402-51-rohs-l-6-r-17063193.pdf?src-supplier=Future+Electronics; ComponentLink3Description: https://datasheet.ciiva.com/17063/pyu-rc0402-51-rohs-l-6-r-17063193.pdf?src-supplier=Future+Electronics; ComponentLink4URL: https://datasheet.ciiva.com/22747/1018594-22747513.pdf?src-supplier=Element14; ComponentLink4Description: https://datasheet.ciiva.com/22747/1018594-22747513.pdf?src-supplier=Element14; ComponentLink5URL: https://datasheet.ciiva.com/7849/1018594-7849869.pdf?src-supplier=Element14; ComponentLink5Description: https://datasheet.ciiva.com/7849/1018594-7849869.pdf?src-supplier=Element14; ComponentLink6URL: https://datasheet.ciiva.com/7983/1018594-7983502.pdf?src-supplier=Element14; ComponentLink6Description: https://datasheet.ciiva.com/7983/1018594-7983502.pdf?src-supplier=Element14; ComponentLink7URL: https://datasheet.ciiva.com/7849/1018594-7849871.pdf?src-supplier=Element14; ComponentLink7Description: https://datasheet.ciiva.com/7849/1018594-7849871.pdf?src-supplier=Element14